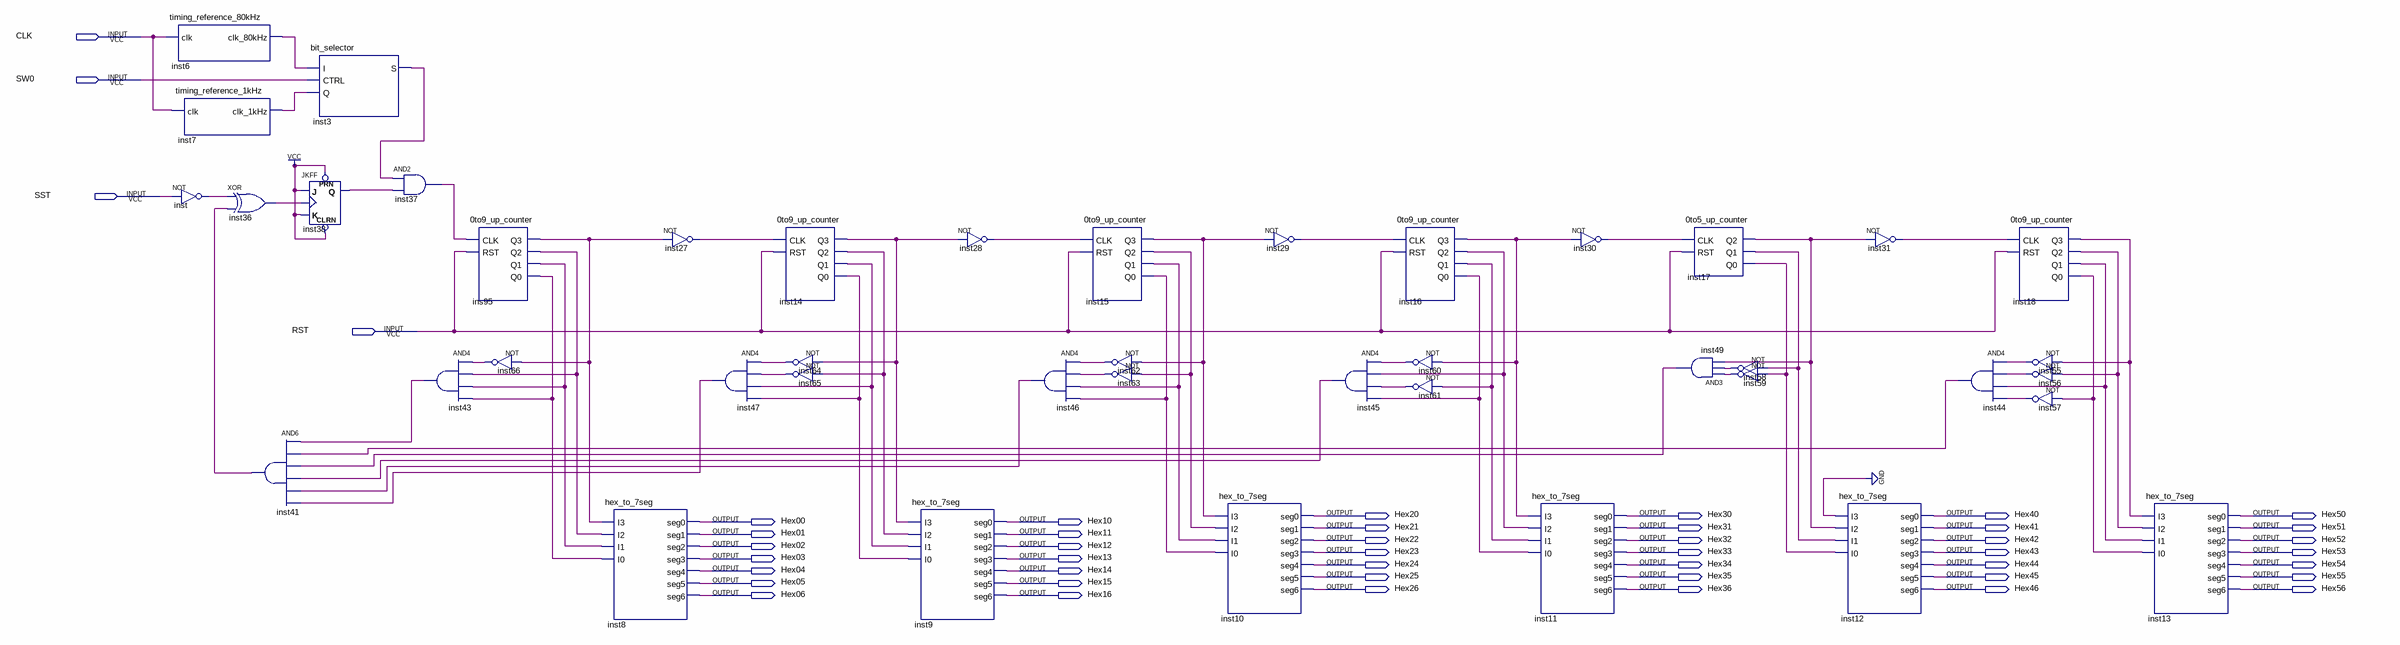
[diagram p0: schematic sheet]
// Quartus schematic lab005.bdf as structural Verilog: 43 symbols, 46 pins
module lab005 (
  input  CLK,
  input  SW0,
  input  SST,
  input  RST,
  output Hex20,
  output Hex30,
  output Hex40,
  output Hex50,
  output Hex00,
  output Hex10,
  output Hex21,
  output Hex31,
  output Hex41,
  output Hex51,
  output Hex01,
  output Hex11,
  output Hex22,
  output Hex32,
  output Hex42,
  output Hex52,
  output Hex02,
  output Hex12,
  output Hex23,
  output Hex33,
  output Hex43,
  output Hex53,
  output Hex03,
  output Hex13,
  output Hex24,
  output Hex34,
  output Hex44,
  output Hex54,
  output Hex04,
  output Hex14,
  output Hex25,
  output Hex35,
  output Hex45,
  output Hex55,
  output Hex05,
  output Hex15,
  output Hex26,
  output Hex36,
  output Hex46,
  output Hex56,
  output Hex06,
  output Hex16
);

  wire ins95_q0, ins95_q1, ins95_q2, ins95_q3, inst3_s, inst6_clk_80khz, inst7_clk_1khz, inst14_q0,
       inst14_q1, inst14_q2, inst14_q3, inst15_q0, inst15_q1, inst15_q2, inst15_q3, inst16_q0, inst16_q1,
       inst16_q2, inst16_q3, inst17_q0, inst17_q1, inst17_q2, inst18_q0, inst18_q1, inst18_q2, inst18_q3,
       inst27_out, inst28_out, inst29_out, inst30_out, inst31_out, inst36_out, inst37_out, inst38_q,
       inst41_out, inst43_out, inst44_out, inst45_out, inst46_out, inst47_out, inst49_out, inst55_out,
       inst56_out, inst57_out, inst58_out, inst59_out, inst60_out, inst61_out, inst62_out, inst63_out,
       inst64_out, inst65_out, inst66_out, inst_out;

  timing_reference_80kHz inst6 (.clk(CLK), .clk_80kHz(inst6_clk_80khz));
  timing_reference_1kHz inst7 (.clk(CLK), .clk_1kHz(inst7_clk_1khz));
  not inst (inst_out, SST);
  xor inst36 (inst36_out, inst_out, inst41_out);
  and inst41 (inst41_out, inst43_out, inst44_out, inst49_out, inst45_out, inst46_out, inst47_out);
  bit_selector inst3 (.I(inst6_clk_80khz), .CTRL(SW0), .Q(inst7_clk_1khz), .S(inst3_s));
  JKFF inst38 (.PRN(1'b1), .CLRN(1'b1), .K(1'b1), .J(1'b1), .CLK(inst36_out), .Q(inst38_q));
  and inst37 (inst37_out, inst3_s, inst38_q);
  and inst43 (inst43_out, inst66_out, ins95_q2, ins95_q1, ins95_q0);
  \0to9_up_counter  ins95 (.CLK(inst37_out), .RST(RST), .Q3(ins95_q3), .Q2(ins95_q2), .Q1(ins95_q1), .Q0(ins95_q0));
  not inst66 (inst66_out, ins95_q3);
  hex_to_7seg inst8 (
    .I3(ins95_q3), .I2(ins95_q2), .I1(ins95_q1), .I0(ins95_q0), .seg0(Hex00), .seg1(Hex01), .seg2(Hex02),
    .seg3(Hex03), .seg4(Hex04), .seg5(Hex05), .seg6(Hex06));
  not inst27 (inst27_out, ins95_q3);
  and inst47 (inst47_out, inst64_out, inst65_out, inst14_q1, inst14_q0);
  \0to9_up_counter  inst14 (
    .CLK(inst27_out), .RST(RST), .Q3(inst14_q3), .Q2(inst14_q2), .Q1(inst14_q1), .Q0(inst14_q0));
  not inst64 (inst64_out, inst14_q3);
  not inst65 (inst65_out, inst14_q2);
  hex_to_7seg inst9 (
    .I3(inst14_q3), .I2(inst14_q2), .I1(inst14_q1), .I0(inst14_q0), .seg0(Hex10), .seg1(Hex11), .seg2(Hex12),
    .seg3(Hex13), .seg4(Hex14), .seg5(Hex15), .seg6(Hex16));
  not inst28 (inst28_out, inst14_q3);
  and inst46 (inst46_out, inst62_out, inst63_out, inst15_q1, inst15_q0);
  \0to9_up_counter  inst15 (
    .CLK(inst28_out), .RST(RST), .Q3(inst15_q3), .Q2(inst15_q2), .Q1(inst15_q1), .Q0(inst15_q0));
  not inst62 (inst62_out, inst15_q3);
  not inst63 (inst63_out, inst15_q2);
  hex_to_7seg inst10 (
    .I3(inst15_q3), .I2(inst15_q2), .I1(inst15_q1), .I0(inst15_q0), .seg0(Hex20), .seg1(Hex21), .seg2(Hex22),
    .seg3(Hex23), .seg4(Hex24), .seg5(Hex25), .seg6(Hex26));
  not inst29 (inst29_out, inst15_q3);
  and inst45 (inst45_out, inst60_out, inst16_q2, inst61_out, inst16_q0);
  \0to9_up_counter  inst16 (
    .CLK(inst29_out), .RST(RST), .Q3(inst16_q3), .Q2(inst16_q2), .Q1(inst16_q1), .Q0(inst16_q0));
  not inst60 (inst60_out, inst16_q3);
  not inst61 (inst61_out, inst16_q1);
  hex_to_7seg inst11 (
    .I3(inst16_q3), .I2(inst16_q2), .I1(inst16_q1), .I0(inst16_q0), .seg0(Hex30), .seg1(Hex31), .seg2(Hex32),
    .seg3(Hex33), .seg4(Hex34), .seg5(Hex35), .seg6(Hex36));
  not inst30 (inst30_out, inst16_q3);
  \0to5_up_counter  inst17 (.CLK(inst30_out), .RST(RST), .Q2(inst17_q2), .Q1(inst17_q1), .Q0(inst17_q0));
  and inst49 (inst49_out, inst59_out, inst58_out, inst17_q2);
  not inst58 (inst58_out, inst17_q1);
  not inst59 (inst59_out, inst17_q0);
  not inst31 (inst31_out, inst17_q2);
  hex_to_7seg inst12 (
    .I3(1'b0), .I2(inst17_q2), .I1(inst17_q1), .I0(inst17_q0), .seg0(Hex40), .seg1(Hex41), .seg2(Hex42),
    .seg3(Hex43), .seg4(Hex44), .seg5(Hex45), .seg6(Hex46));
  and inst44 (inst44_out, inst55_out, inst56_out, inst18_q1, inst57_out);
  \0to9_up_counter  inst18 (
    .CLK(inst31_out), .RST(RST), .Q3(inst18_q3), .Q2(inst18_q2), .Q1(inst18_q1), .Q0(inst18_q0));
  not inst55 (inst55_out, inst18_q3);
  not inst56 (inst56_out, inst18_q2);
  not inst57 (inst57_out, inst18_q0);
  hex_to_7seg inst13 (
    .I3(inst18_q3), .I2(inst18_q2), .I1(inst18_q1), .I0(inst18_q0), .seg0(Hex50), .seg1(Hex51), .seg2(Hex52),
    .seg3(Hex53), .seg4(Hex54), .seg5(Hex55), .seg6(Hex56));
endmodule
